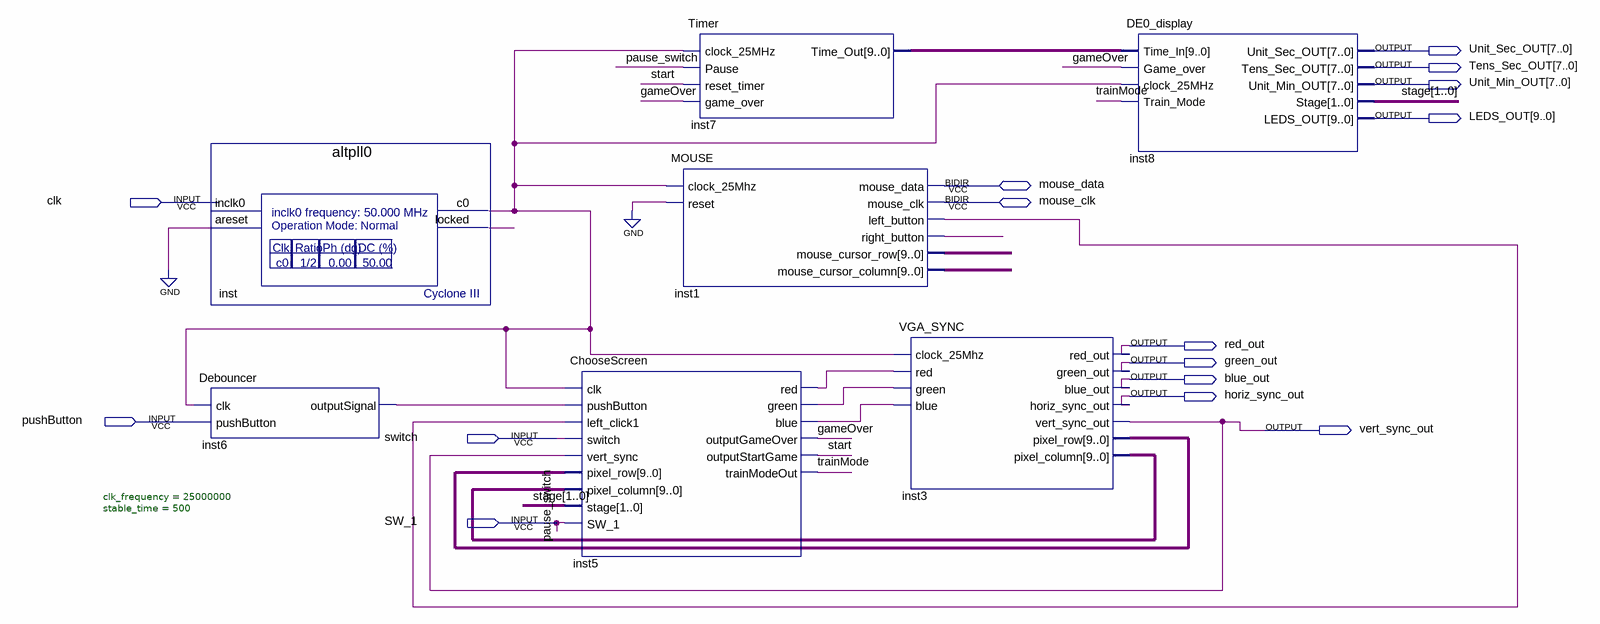
[diagram p0: schematic sheet]
// Quartus schematic SwitchScreens.bdf as structural Verilog: 7 symbols, 15 pins
module SwitchScreens (
  input  clk,
  input  pushButton,
  input  switch,
  input  SW_1,
  inout  mouse_data,
  inout  mouse_clk,
  output [7:0] Unit_Sec_OUT,
  output [7:0] Tens_Sec_OUT,
  output [7:0] Unit_Min_OUT,
  output [9:0] LEDS_OUT,
  output red_out,
  output green_out,
  output blue_out,
  output horiz_sync_out,
  output vert_sync_out
);

  wire gameOver, inst1_left_button, inst1_right_button, inst5_blue, inst5_green, inst5_red,
       inst6_outputsignal, inst_c0, inst_locked, start, trainMode;
  wire [1:0] stage;
  wire [9:0] inst1_mouse_cursor_column, inst1_mouse_cursor_row, inst3_pixel_column, inst3_pixel_row,
       inst7_time_out;

  altpll0 inst (.inclk0(clk), .areset(1'b0), .c0(inst_c0), .locked(inst_locked));
  Debouncer #(.clk_frequency(25000000), .stable_time(500)) inst6 (
    .clk(inst_c0), .pushButton(pushButton), .outputSignal(inst6_outputsignal));
  ChooseScreen inst5 (
    .clk(inst_c0), .pushButton(inst6_outputsignal), .left_click1(inst1_left_button), .switch(switch),
    .vert_sync(vert_sync_out), .pixel_row(inst3_pixel_row), .pixel_column(inst3_pixel_column), .stage(stage),
    .SW_1(SW_1), .red(inst5_red), .green(inst5_green), .blue(inst5_blue), .outputGameOver(gameOver),
    .outputStartGame(start), .trainModeOut(trainMode));
  Timer inst7 (
    .clock_25MHz(inst_c0), .Pause(SW_1), .reset_timer(start), .game_over(gameOver), .Time_Out(inst7_time_out));
  MOUSE inst1 (
    .clock_25Mhz(inst_c0), .reset(1'b0), .left_button(inst1_left_button), .right_button(inst1_right_button),
    .mouse_cursor_row(inst1_mouse_cursor_row), .mouse_cursor_column(inst1_mouse_cursor_column),
    .mouse_data(mouse_data), .mouse_clk(mouse_clk));
  VGA_SYNC inst3 (
    .clock_25Mhz(inst_c0), .red(inst5_red), .green(inst5_green), .blue(inst5_blue), .red_out(red_out),
    .green_out(green_out), .blue_out(blue_out), .horiz_sync_out(horiz_sync_out),
    .vert_sync_out(vert_sync_out), .pixel_row(inst3_pixel_row), .pixel_column(inst3_pixel_column));
  DE0_display inst8 (
    .Time_In(inst7_time_out), .Game_over(gameOver), .clock_25MHz(inst_c0), .Train_Mode(trainMode),
    .Unit_Sec_OUT(Unit_Sec_OUT), .Tens_Sec_OUT(Tens_Sec_OUT), .Unit_Min_OUT(Unit_Min_OUT), .Stage(stage),
    .LEDS_OUT(LEDS_OUT));

  // Other names for the same wires on the sheet: pause_switch = SW_1
endmodule
